# EAGLE design VHDL projekt (EAGLE 6.5.0)
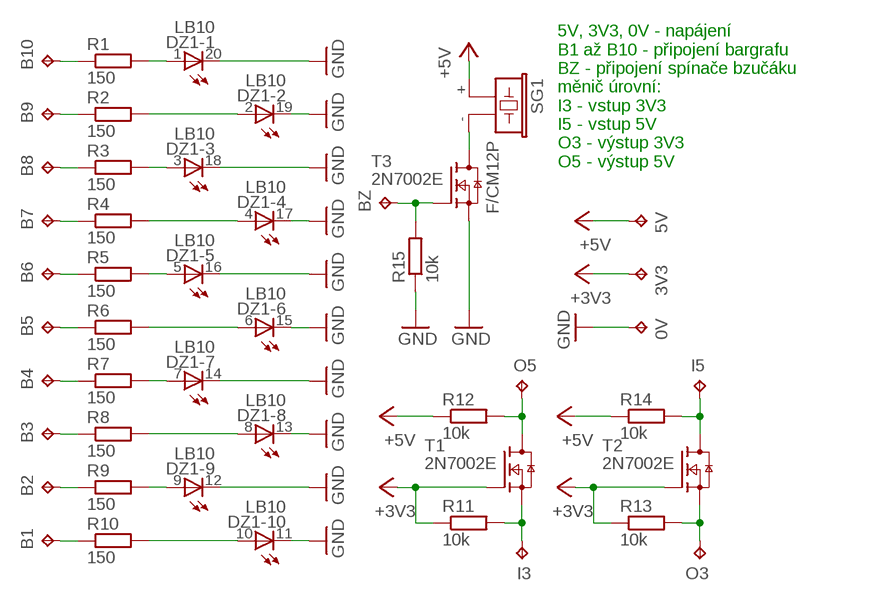
[diagram p0: schematic, sheet 1]

## Parts
0V  TPPAD1-13Y  [P1-13Y]
3V3  TPPAD1-13Y  [P1-13Y]
5V  TPPAD1-13Y  [P1-13Y]
B1  TPPAD1-13Y  [P1-13Y]
B2  TPPAD1-13Y  [P1-13Y]
B3  TPPAD1-13Y  [P1-13Y]
B4  TPPAD1-13Y  [P1-13Y]
B5  TPPAD1-13Y  [P1-13Y]
B6  TPPAD1-13Y  [P1-13Y]
B7  TPPAD1-13Y  [P1-13Y]
B8  TPPAD1-13Y  [P1-13Y]
B9  TPPAD1-13Y  [P1-13Y]
B10  TPPAD1-13Y  [P1-13Y]
BZ  TPPAD1-13Y  [P1-13Y]
DZ1  LB10  [LB10]
I3  TPPAD1-13Y  [P1-13Y]
I5  TPPAD1-13Y  [P1-13Y]
O3  TPPAD1-13Y  [P1-13Y]
O5  TPPAD1-13Y  [P1-13Y]
R1  150  R-EU_R1206  [R1206]
R2  150  R-EU_R1206  [R1206]
R3  150  R-EU_R1206  [R1206]
R4  150  R-EU_R1206  [R1206]
R5  150  R-EU_R1206  [R1206]
R6  150  R-EU_R1206  [R1206]
R7  150  R-EU_R1206  [R1206]
R8  150  R-EU_R1206  [R1206]
R9  150  R-EU_R1206  [R1206]
R10  150  R-EU_R1206  [R1206]
R11  10k  R-EU_R1206  [R1206]
R12  10k  R-EU_R1206  [R1206]
R13  10k  R-EU_R1206  [R1206]
R14  10k  R-EU_R1206  [R1206]
R15  10k  R-EU_R1206  [R1206]
SG1  F/CM12P  [F/CM12P]
T1  2N7002E  [SOT23]
T2  2N7002E  [SOT23]
T3  2N7002E  [SOT23]

## Nets
+3V3: 3V3.TP R11.1 R13.1 T1.1(G) T2.1(G)
+5V: 5V.TP R12.1 R14.1 SG1.+
GND: 0V.TP DZ1.11(-10:C) DZ1.12(-9:C) DZ1.13(-8:C) DZ1.14(-7:C) DZ1.15(-6:C) DZ1.16(-5:C) DZ1.17(-4:C) DZ1.18(-3:C) DZ1.19(-2:C) DZ1.20(-1:C) R15.1 T3.2(S)
N$1: DZ1.1(-1:A) R1.2
N$2: DZ1.2(-2:A) R2.2
N$3: DZ1.3(-3:A) R3.2
N$4: DZ1.4(-4:A) R4.2
N$5: DZ1.5(-5:A) R5.2
N$6: DZ1.6(-6:A) R6.2
N$7: DZ1.7(-7:A) R7.2
N$8: DZ1.8(-8:A) R8.2
N$9: DZ1.9(-9:A) R9.2
N$10: DZ1.10(-10:A) R10.2
N$11: B10.TP R1.1
N$12: B9.TP R2.1
N$13: B8.TP R3.1
N$14: B7.TP R4.1
N$15: B6.TP R5.1
N$16: B5.TP R6.1
N$17: B4.TP R7.1
N$18: B3.TP R8.1
N$19: B2.TP R9.1
N$20: B1.TP R10.1
N$21: O5.TP R12.2 T1.3(D)
N$22: I3.TP R11.2 T1.2(S)
N$23: I5.TP R14.2 T2.3(D)
N$24: O3.TP R13.2 T2.2(S)
N$25: BZ.TP R15.2 T3.1(G)
N$26: SG1.- T3.3(D)

## Notes on the sheet
- 5V, 3V3, 0V - napájení
  B1 až B10 - připojení bargrafu
  BZ - připojení spínače bzučáku
  měnič úrovní:
  I3 - vstup 3V3
  I5 - vstup 5V
  O3 - výstup 3V3
  O5 - výstup 5V

## Library data of the parts
0V 3V3 5V B1-B10 BZ I3 I5 O3 O5 = testpad:TP: Test pad
DZ1 = led:LB10: LED BLOCK 10-LED bar graph, DIL, Siemens
R1-R15 = rcl:R-EU_: RESISTOR, European symbol
SG1 = buzzer:F/CM12P: BUZZER Source: Buerklin; OC_FARNELL: unknown; OC_NEWARK: unknown
T1-T3 = nxp_60:2N7002: N-channel TrenchMOS FET N-channel enhancement mode Field-Effect Transistor (FET) in a plastic package using TrenchMOS technology. AAL Eindhoven MK

## Board
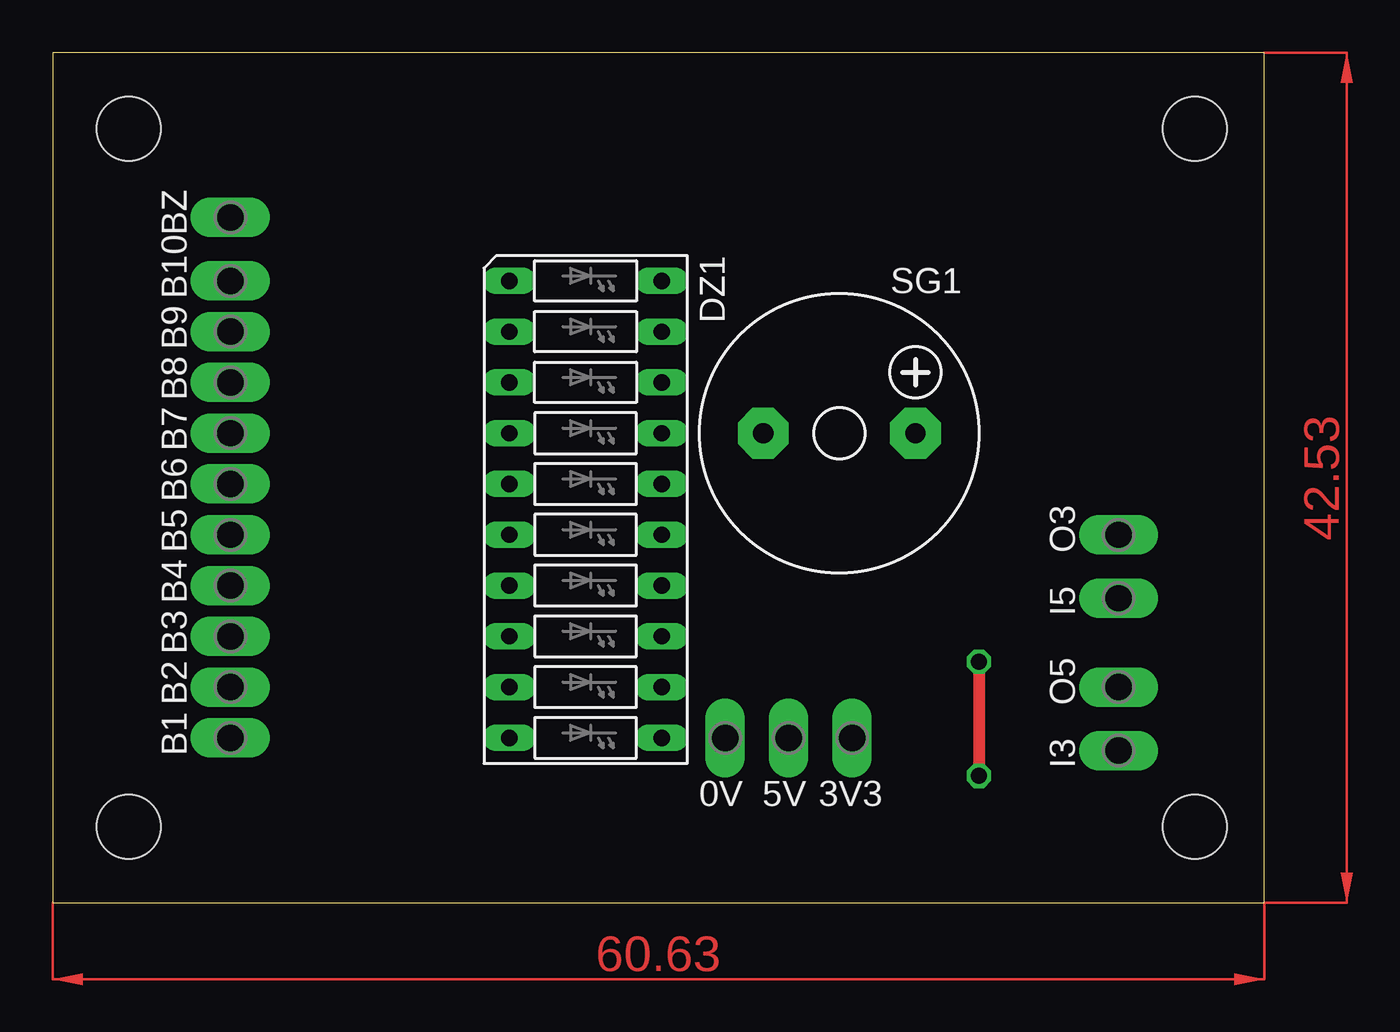
[diagram p1: board, top side]
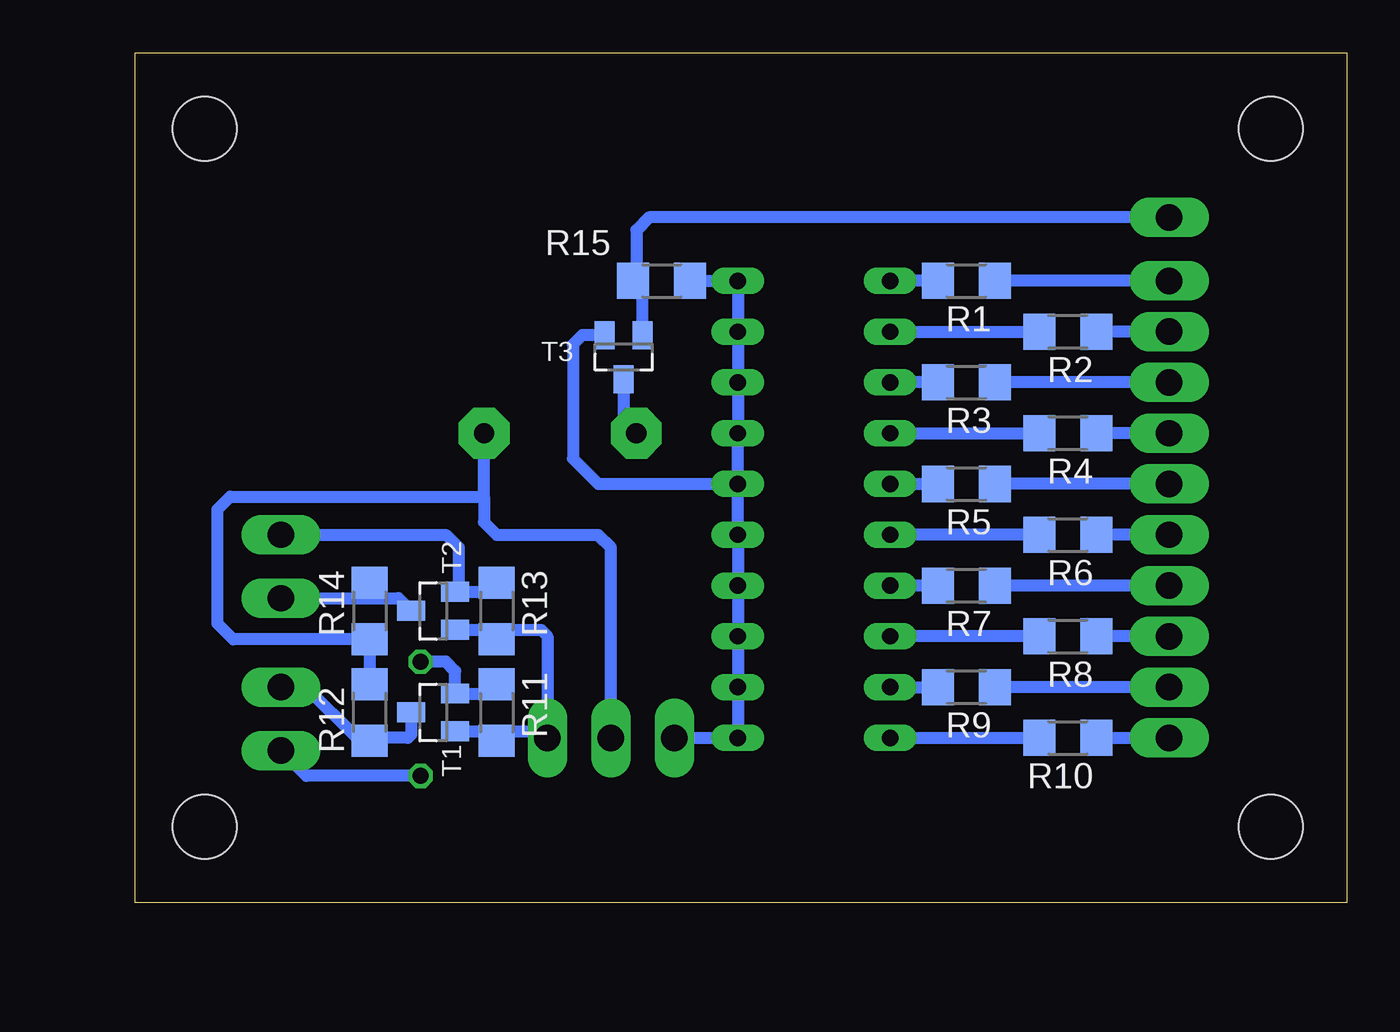
[diagram p2: board, bottom side, seen from below]

Size 60.63 x 42.53 mm. Coordinates in mm from the lower left corner, seen from the top.
Outline: 0,0 60.63,0 60.63,42.53 0,42.53 0,0
Copper layers (1*16): Top 0.035mm / dielectric 1.5mm / Bottom 0.035mm
Design rules "default": minimum track width 10mil, minimum drill 24mil, track to track 8mil, track to pad 8mil, pad to pad 8mil, via to via 8mil, smd to smd 8mil, copper to edge 40mil, drill to drill 8mil, minimum pad ring 10mil, minimum via ring 8mil, stop-mask expansion 4mil, vias tented up to drill 0mil, thermal gap 10mil
Holes 3.2 mm at 3.81,38.73 57.15,38.73 3.81,3.81 57.15,3.81

### Footprints (pad centres in the part's own frame; a part is rotated, then mirrored left to right if it is on the bottom)
P1-13Y = drill 1.321 pad 1.905 long: TP 0,0
LB10 = drill 0.813 long: 1 -11.43,-3.81; 2 -8.89,-3.81; 3 -6.35,-3.81; 4 -3.81,-3.81; 5 -1.27,-3.81; 6 1.27,-3.81; 7 3.81,-3.81; 8 6.35,-3.81; 9 8.89,-3.81; 10 11.43,-3.81; 11 11.43,3.81; 12 8.89,3.81; 13 6.35,3.81; 14 3.81,3.81; 15 1.27,3.81; 16 -1.27,3.81; 17 -3.81,3.81; 18 -6.35,3.81; 19 -8.89,3.81; 20 -11.43,3.81
R1206 = smd 1.6 x 1.803: 1 -1.422,0; 2 1.422,0
F/CM12P = drill 1.016 pad 2.54 octagon: + 3.81,0; - -3.81,0
SOT23 = smd 1 x 1.4: 1 -0.95,-1.1; 2 0.95,-1.1; 3 0,1.1

### Placement (x,y rotation side)
0V  33.66,8.26 180 top
3V3  40.01,8.26 180 top
5V  36.83,8.26 180 top
B1  8.89,8.26 90 top
B2  8.89,10.79 90 top
B3  8.89,13.34 90 top
B4  8.89,15.88 90 top
B5  8.89,18.41 90 top
B6  8.89,20.95 90 top
B7  8.89,23.5 90 top
B8  8.89,26.04 90 top
B9  8.89,28.57 90 top
B10  8.89,31.11 90 top
BZ  8.89,34.29 90 top
DZ1  26.67,19.68 270 top
I3  53.34,7.62 90 top
I5  53.34,15.24 90 top
O3  53.34,18.41 90 top
O5  53.34,10.79 90 top
R1  19.05,31.11 180 bottom
R2  13.97,28.57 180 bottom
R3  19.05,26.04 180 bottom
R4  13.97,23.5 180 bottom
R5  19.05,20.95 180 bottom
R6  13.97,18.41 180 bottom
R7  19.05,15.88 180 bottom
R8  13.97,13.34 180 bottom
R9  19.05,10.79 180 bottom
R10  13.97,8.26 180 bottom
R11  42.55,9.53 90 bottom
R12  48.9,9.53 270 bottom
R13  42.55,14.61 90 bottom
R14  48.9,14.61 90 bottom
R15  34.29,31.11 180 bottom
SG1  39.37,23.5 0 top
T1  45.72,9.53 90 bottom
T2  45.72,14.61 90 bottom
T3  36.2,27.3 180 bottom

### Tracks (layer width: path | path; a pad name or v marks a point on that pad's centre or on a via)
+3V3
  Bottom 0.61: 40.01,8.89 40.01,13.34 40.33,13.65 43.18,13.65 | 40.01,8.89 3V3.TP | T1.1 41.91,8.57 | 41.91,8.57 40.32,8.57 40.01,8.89 | R11.1 42.38,8.1 41.91,8.57 | T2.1 43.18,13.65 | R13.1 42.71,13.18 43.18,13.65
+5V
  Bottom 0.61: 5V.TP 36.83,17.78 37.47,18.41 42.55,18.41 43.18,19.05 43.18,20.32 | 43.18,20.32 SG1.+ | R12.1 R14.1 55.73,13.18 56.52,13.97 56.52,19.68 55.88,20.32 43.18,20.32
GND
  Bottom 0.61: DZ1.16 DZ1.17 DZ1.18 DZ1.19 DZ1.20 R15.1 | DZ1.16 DZ1.15 DZ1.14 DZ1.13 DZ1.12 DZ1.11 0V.TP | T3.2 38.27,28.41 38.73,27.94 38.73,22.23 37.47,20.95 DZ1.16
N$1
  Bottom 0.61: R1.2 DZ1.1
N$2
  Bottom 0.61: DZ1.2 R2.2
N$3
  Bottom 0.61: R3.2 DZ1.3
N$4
  Bottom 0.61: DZ1.4 R4.2
N$5
  Bottom 0.61: DZ1.5 R5.2
N$6
  Bottom 0.61: R6.2 DZ1.6
N$7
  Bottom 0.61: R7.2 DZ1.7
N$8
  Bottom 0.61: R8.2 DZ1.8
N$9
  Bottom 0.61: DZ1.9 R9.2
N$10
  Bottom 0.61: DZ1.10 R10.2
N$11
  Bottom 0.61: B10.TP R1.1
N$12
  Bottom 0.61: B9.TP R2.1
N$13
  Bottom 0.61: B8.TP R3.1
N$14
  Bottom 0.61: B7.TP R4.1
N$15
  Bottom 0.61: B6.TP R5.1
N$16
  Bottom 0.61: B5.TP R6.1
N$17
  Bottom 0.61: B4.TP R7.1
N$18
  Bottom 0.61: B3.TP R8.1
N$19
  Bottom 0.61: B2.TP R9.1
N$20
  Bottom 0.61: R10.1 B1.TP
N$21
  Bottom 0.61: T1.3 46.82,8.43 46.99,8.26 48.74,8.26 R12.2 49.05,8.26 49.53,8.26 52.07,10.79 O5.TP
N$22  (via drill 0.8)
  Top 0.61: v46.35,12.06 v46.35,6.35
  Bottom 0.61: R11.2 43.02,10.47 T1.2 44.62,11.6 45.09,12.06 v46.35,12.06 | v46.35,6.35 52.07,6.35 I3.TP
N$23
  Bottom 0.61: I5.TP 49.53,15.24 | 49.53,15.24 47.45,15.24 T2.3 | R14.2 48.9,15.88 49.53,15.24
N$24
  Bottom 0.61: R13.2 43.02,15.55 T2.2 44.45,15.72 44.45,17.78 45.09,18.41 O3.TP
N$25
  Bottom 0.61: BZ.TP 34.92,34.29 35.56,33.66 35.56,31.27 R15.2 35.24,30.65 T3.1
N$26
  Bottom 0.61: T3.3 36.2,24.13 SG1.-
(copper drawn outside any net)
  shapes: Top area x2